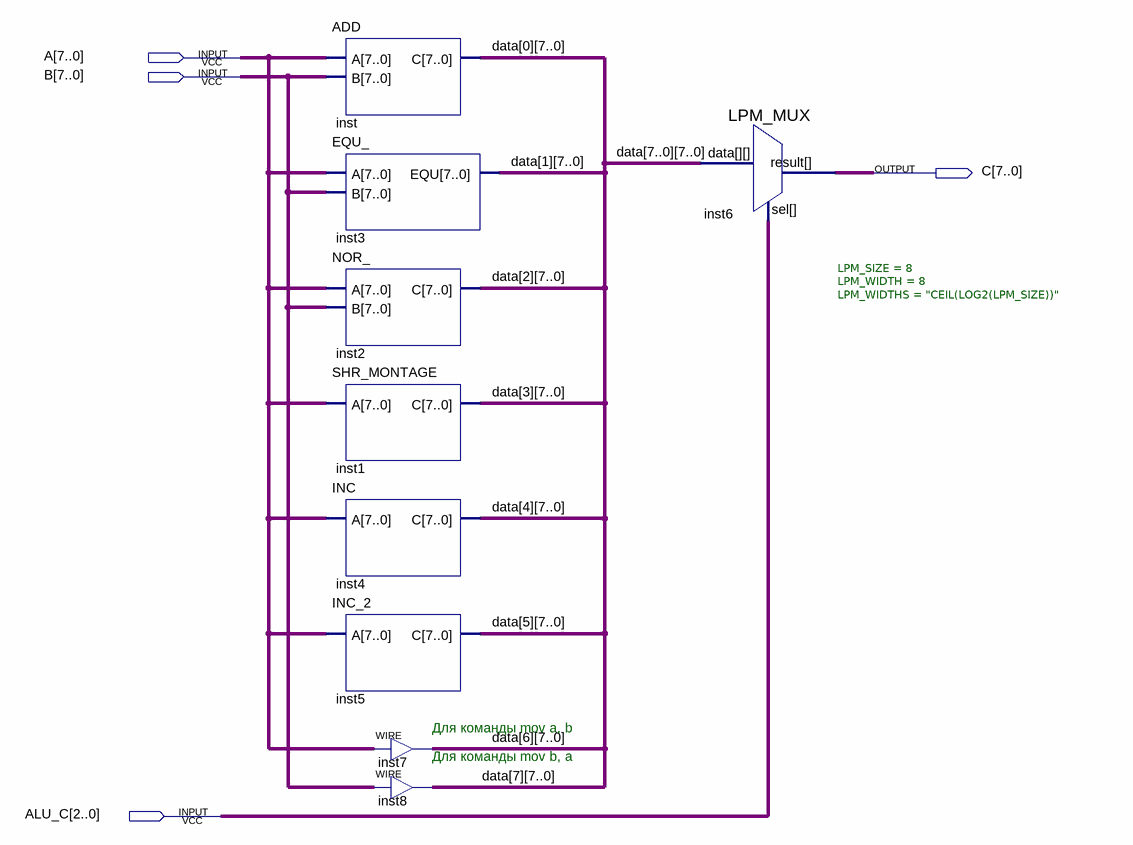
[diagram p0: schematic sheet]
// Quartus schematic ALU.bdf as structural Verilog: 9 symbols, 4 pins
module ALU (
  input  [7:0] A,
  input  [7:0] B,
  input  [2:0] ALU_C,
  output [7:0] C
);

  wire [7:0] data_0, data_1, data_2, data_3, data_4, data_5, data_6, data_7;

  ADD inst (.A(A), .B(B), .C(data_0));
  EQU_ inst3 (.A(A), .B(B), .EQU(data_1));
  NOR_ inst2 (.A(A), .B(B), .C(data_2));
  SHR_MONTAGE inst1 (.A(A), .C(data_3));
  INC inst4 (.A(A), .C(data_4));
  INC_2 inst5 (.A(A), .C(data_5));
  assign data_6 = A;  // WIRE inst7
  assign data_7 = B;  // WIRE inst8
  LPM_MUX #(.LPM_SIZE(8), .LPM_WIDTH(8), .LPM_WIDTHS("CEIL(LOG2(LPM_SIZE))")) inst6 (
    .data({data_7, data_6, data_5, data_4, data_3, data_2, data_1, data_0}), .sel(ALU_C), .result(C));

  // Notes on the sheet:
  //   Для команды mov a, b
  //   Для команды mov b, a
endmodule
